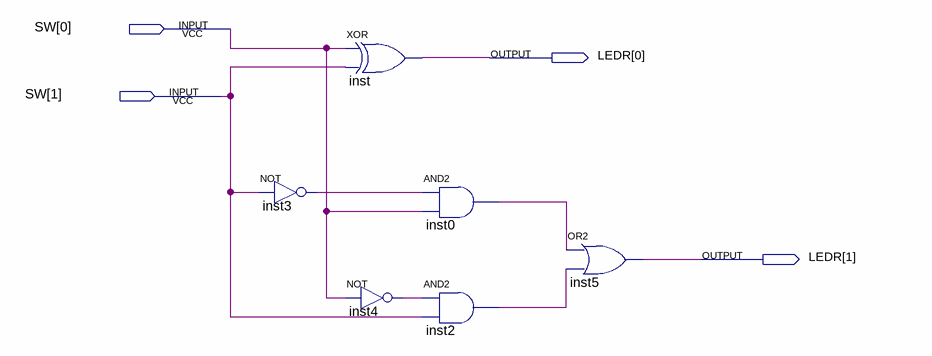
[diagram p0: schematic sheet]
// Quartus schematic PROJETO1.bdf as structural Verilog: 6 symbols, 4 pins
module PROJETO1 (
  input  [1:0] SW,
  output [1:0] LEDR
);

  wire inst0_out, inst2_out, inst3_out, inst4_out;

  not inst3 (inst3_out, SW[1]);
  xor inst (LEDR[0], SW[0], SW[1]);
  not inst4 (inst4_out, SW[0]);
  and inst0 (inst0_out, inst3_out, SW[0]);
  and inst2 (inst2_out, inst4_out, SW[1]);
  or inst5 (LEDR[1], inst0_out, inst2_out);
endmodule
